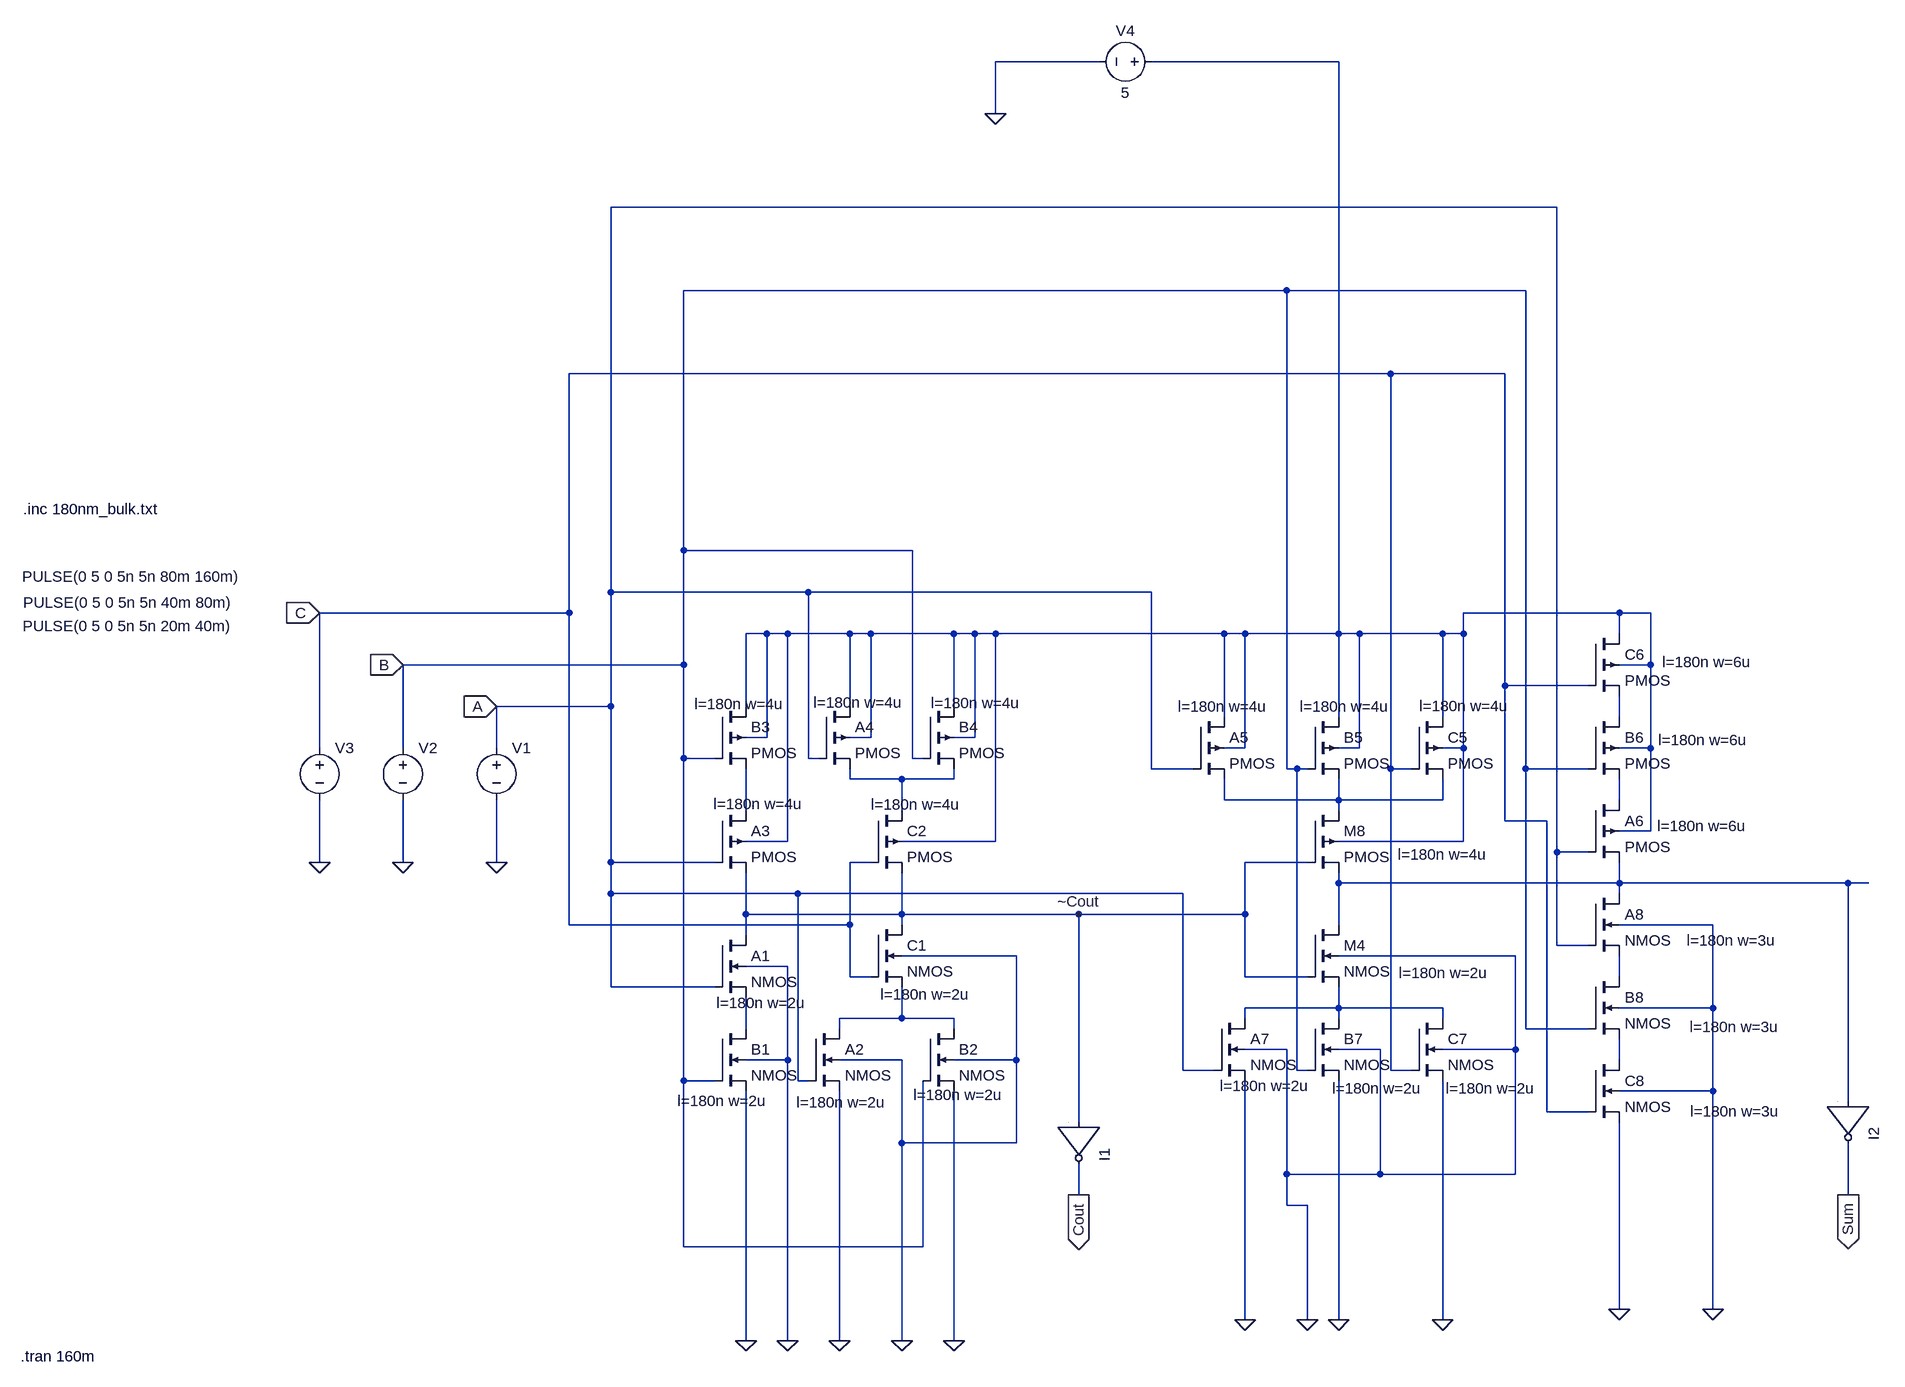
[diagram p0: schematic Full_Adder_1.asc]
Full_Adder_1.asc, the LTspice schematic file:
Version 4
SHEET 1 1716 680
WIRE 480 -1328 320 -1328
WIRE 848 -1328 560 -1328
WIRE 320 -1248 320 -1328
WIRE 1184 -1104 -272 -1104
WIRE 768 -976 -160 -976
WIRE 1136 -976 768 -976
WIRE 928 -848 -336 -848
WIRE 1104 -848 928 -848
WIRE -160 -576 -160 -976
WIRE 192 -576 -160 -576
WIRE -272 -512 -272 -1104
WIRE 32 -512 -272 -512
WIRE 560 -512 32 -512
WIRE -336 -480 -336 -848
WIRE -336 -480 -720 -480
WIRE 1280 -480 1040 -480
WIRE 1328 -480 1280 -480
WIRE -32 -448 -64 -448
WIRE 0 -448 -32 -448
WIRE 96 -448 0 -448
WIRE 128 -448 96 -448
WIRE 256 -448 128 -448
WIRE 288 -448 256 -448
WIRE 320 -448 288 -448
WIRE 672 -448 320 -448
WIRE 704 -448 672 -448
WIRE 848 -448 848 -1328
WIRE 848 -448 704 -448
WIRE 880 -448 848 -448
WIRE 1008 -448 880 -448
WIRE 1040 -448 1040 -480
WIRE 1040 -448 1008 -448
WIRE 1280 -448 1280 -480
WIRE -160 -400 -160 -576
WIRE -160 -400 -592 -400
WIRE 1328 -400 1328 -480
WIRE 1328 -400 1280 -400
WIRE 1104 -368 1104 -848
WIRE 1232 -368 1104 -368
WIRE -272 -336 -272 -512
WIRE -272 -336 -448 -336
WIRE -64 -336 -64 -448
WIRE 96 -336 96 -448
WIRE 256 -336 256 -448
WIRE 672 -320 672 -448
WIRE 848 -320 848 -448
WIRE 1008 -320 1008 -448
WIRE 1280 -320 1280 -352
WIRE -32 -288 -32 -448
WIRE -32 -288 -64 -288
WIRE 128 -288 128 -448
WIRE 128 -288 96 -288
WIRE 288 -288 288 -448
WIRE 288 -288 256 -288
WIRE -720 -272 -720 -480
WIRE -592 -272 -592 -400
WIRE -448 -272 -448 -336
WIRE 704 -272 704 -448
WIRE 704 -272 672 -272
WIRE 880 -272 880 -448
WIRE 880 -272 848 -272
WIRE 1040 -272 1040 -448
WIRE 1040 -272 1008 -272
WIRE 1328 -272 1328 -400
WIRE 1328 -272 1280 -272
WIRE -160 -256 -160 -400
WIRE -112 -256 -160 -256
WIRE 32 -256 32 -512
WIRE 48 -256 32 -256
WIRE 192 -256 192 -576
WIRE 208 -256 192 -256
WIRE 560 -240 560 -512
WIRE 624 -240 560 -240
WIRE 768 -240 768 -976
WIRE 784 -240 768 -240
WIRE 800 -240 784 -240
WIRE 928 -240 928 -848
WIRE 960 -240 928 -240
WIRE 1136 -240 1136 -976
WIRE 1232 -240 1136 -240
WIRE 96 -224 96 -240
WIRE 176 -224 96 -224
WIRE 256 -224 256 -240
WIRE 256 -224 176 -224
WIRE 672 -192 672 -224
WIRE 848 -192 848 -224
WIRE 848 -192 672 -192
WIRE 1008 -192 1008 -224
WIRE 1008 -192 848 -192
WIRE 1280 -192 1280 -224
WIRE -64 -176 -64 -240
WIRE 176 -176 176 -224
WIRE 848 -176 848 -192
WIRE 1104 -160 1104 -368
WIRE 1168 -160 1104 -160
WIRE 1328 -144 1328 -272
WIRE 1328 -144 1280 -144
WIRE 0 -128 0 -448
WIRE 0 -128 -64 -128
WIRE 320 -128 320 -448
WIRE 320 -128 176 -128
WIRE 1040 -128 1040 -272
WIRE 1040 -128 848 -128
WIRE 1184 -112 1184 -1104
WIRE 1232 -112 1184 -112
WIRE -720 -96 -720 -192
WIRE -592 -96 -592 -192
WIRE -448 -96 -448 -192
WIRE -272 -96 -272 -336
WIRE -112 -96 -272 -96
WIRE 128 -96 96 -96
WIRE 800 -96 704 -96
WIRE 848 -64 848 -80
WIRE 1280 -64 1280 -96
WIRE 1280 -64 848 -64
WIRE 1632 -64 1280 -64
WIRE 1664 -64 1632 -64
WIRE -272 -48 -272 -96
WIRE 16 -48 -272 -48
WIRE 608 -48 16 -48
WIRE 1280 -48 1280 -64
WIRE -64 -16 -64 -80
WIRE 176 -16 176 -80
WIRE 176 -16 -64 -16
WIRE 448 -16 176 -16
WIRE 704 -16 704 -96
WIRE 704 -16 448 -16
WIRE -336 0 -336 -480
WIRE 96 0 96 -96
WIRE 96 0 -336 0
WIRE 176 0 176 -16
WIRE 848 0 848 -64
WIRE 1424 0 1280 0
WIRE -64 16 -64 -16
WIRE 1184 32 1184 -112
WIRE 1232 32 1184 32
WIRE 352 48 176 48
WIRE 1120 48 848 48
WIRE 0 64 -64 64
WIRE 96 80 96 0
WIRE 128 80 96 80
WIRE 704 80 704 -16
WIRE 800 80 704 80
WIRE 1280 80 1280 48
WIRE -272 96 -272 -48
WIRE -112 96 -272 96
WIRE 848 128 848 96
WIRE 848 128 704 128
WIRE 1008 128 848 128
WIRE 1424 128 1424 0
WIRE 1424 128 1280 128
WIRE 176 144 176 96
WIRE 176 144 80 144
WIRE 256 144 176 144
WIRE 704 144 704 128
WIRE 848 144 848 128
WIRE 1008 144 1008 128
WIRE -64 160 -64 112
WIRE 80 160 80 144
WIRE 256 160 256 144
WIRE 1136 160 1136 -240
WIRE 1232 160 1136 160
WIRE 768 192 704 192
WIRE 912 192 848 192
WIRE 1120 192 1120 48
WIRE 1120 192 1008 192
WIRE 0 208 0 64
WIRE 0 208 -64 208
WIRE 176 208 80 208
WIRE 352 208 352 48
WIRE 352 208 256 208
WIRE 1280 208 1280 176
WIRE 608 224 608 -48
WIRE 656 224 608 224
WIRE 784 224 784 -240
WIRE 800 224 784 224
WIRE 928 224 928 -240
WIRE 960 224 928 224
WIRE -160 240 -160 -256
WIRE -112 240 -160 240
WIRE 16 240 16 -48
WIRE 32 240 16 240
WIRE 1424 256 1424 128
WIRE 1424 256 1280 256
WIRE 1632 272 1632 -64
WIRE 1168 288 1168 -160
WIRE 1232 288 1168 288
WIRE 448 304 448 -16
WIRE 176 336 176 208
WIRE 352 336 352 208
WIRE 352 336 176 336
WIRE 768 384 768 192
WIRE 912 384 912 192
WIRE 912 384 768 384
WIRE 1120 384 1120 192
WIRE 1120 384 912 384
WIRE 448 416 448 368
WIRE 1632 416 1632 336
WIRE 768 432 768 384
WIRE 800 432 768 432
WIRE -160 496 -160 240
WIRE 208 496 208 240
WIRE 208 496 -160 496
WIRE 1280 592 1280 304
WIRE 1424 592 1424 256
WIRE 704 608 704 240
WIRE 800 608 800 432
WIRE 848 608 848 240
WIRE 1008 608 1008 240
WIRE -64 640 -64 256
WIRE 0 640 0 208
WIRE 80 640 80 256
WIRE 176 640 176 336
WIRE 256 640 256 256
FLAG 448 -16 ~Cout
FLAG -64 640 0
FLAG 80 640 0
FLAG 256 640 0
FLAG 0 640 0
FLAG 176 640 0
FLAG 704 608 0
FLAG 848 608 0
FLAG 1008 608 0
FLAG 800 608 0
FLAG 1280 592 0
FLAG 1424 592 0
FLAG -448 -96 0
FLAG -592 -96 0
FLAG -720 -96 0
FLAG 320 -1248 0
FLAG -720 -480 C
IOPIN -720 -480 In
FLAG -448 -336 A
IOPIN -448 -336 In
FLAG -592 -400 B
IOPIN -592 -400 In
FLAG 448 416 Cout
IOPIN 448 416 Out
FLAG 1632 416 Sum
IOPIN 1632 416 Out
SYMBOL nmos4 208 160 R0
WINDOW 123 -14 102 Left 2
SYMATTR InstName B2
SYMATTR Value2 l=180n w=2u
SYMBOL nmos4 32 160 R0
WINDOW 123 -18 113 Left 2
SYMATTR InstName A2
SYMATTR Value2 l=180n w=2u
SYMBOL nmos4 128 0 R0
WINDOW 123 15 107 Left 2
SYMATTR InstName C1
SYMATTR Value2 l=180n w=2u
SYMBOL nmos4 -112 16 R0
WINDOW 123 3 104 Left 2
SYMATTR InstName A1
SYMATTR Value2 l=180n w=2u
SYMBOL nmos4 -112 160 R0
WINDOW 123 -57 111 Left 2
SYMATTR InstName B1
SYMATTR Value2 l=180n w=2u
SYMBOL pmos4 128 -176 R0
WINDOW 123 0 -9 Left 2
SYMATTR InstName C2
SYMATTR Value2 l=180n w=4u
SYMBOL pmos4 48 -336 R0
WINDOW 123 -8 -6 Left 2
SYMATTR InstName A4
SYMATTR Value2 l=180n w=4u
SYMBOL pmos4 208 -336 R0
WINDOW 123 13 -5 Left 2
SYMATTR InstName B4
SYMATTR Value2 l=180n w=4u
SYMBOL pmos4 -112 -176 R0
WINDOW 123 -2 -10 Left 2
SYMATTR InstName A3
SYMATTR Value2 l=180n w=4u
SYMBOL pmos4 -112 -336 R0
WINDOW 123 -31 -4 Left 2
SYMATTR InstName B3
SYMATTR Value2 l=180n w=4u
SYMBOL Digital\\inv 512 304 R90
SYMATTR InstName I1
SYMBOL nmos4 656 144 R0
WINDOW 123 9 104 Left 2
SYMATTR InstName A7
SYMATTR Value2 l=180n w=2u
SYMBOL nmos4 800 144 R0
WINDOW 123 38 108 Left 2
SYMATTR InstName B7
SYMATTR Value2 l=180n w=2u
SYMBOL nmos4 960 144 R0
WINDOW 123 53 108 Left 2
SYMATTR InstName C7
SYMATTR Value2 l=180n w=2u
SYMBOL nmos4 800 0 R0
WINDOW 123 141 74 Left 2
SYMATTR InstName M4
SYMATTR Value2 l=180n w=2u
SYMBOL nmos4 1232 -48 R0
WINDOW 123 152 72 Left 2
SYMATTR InstName A8
SYMATTR Value2 l=180n w=3u
SYMBOL nmos4 1232 80 R0
WINDOW 123 156 77 Left 2
SYMATTR InstName B8
SYMATTR Value2 l=180n w=3u
SYMBOL nmos4 1232 208 R0
WINDOW 123 157 79 Left 2
SYMATTR InstName C8
SYMATTR Value2 l=180n w=3u
SYMBOL pmos4 800 -176 R0
WINDOW 123 139 68 Left 2
SYMATTR InstName M8
SYMATTR Value2 l=180n w=4u
SYMBOL pmos4 624 -320 R0
WINDOW 123 -23 -16 Left 2
SYMATTR InstName A5
SYMATTR Value2 l=180n w=4u
SYMBOL pmos4 800 -320 R0
WINDOW 123 -12 -16 Left 2
SYMATTR InstName B5
SYMATTR Value2 l=180n w=4u
SYMBOL pmos4 960 -320 R0
WINDOW 123 12 -17 Left 2
SYMATTR InstName C5
SYMATTR Value2 l=180n w=4u
SYMBOL pmos4 1232 -192 R0
WINDOW 123 106 40 Left 2
SYMATTR InstName A6
SYMATTR Value2 l=180n w=6u
SYMBOL pmos4 1232 -320 R0
WINDOW 123 108 36 Left 2
SYMATTR InstName B6
SYMATTR Value2 l=180n w=6u
SYMBOL pmos4 1232 -448 R0
WINDOW 123 114 44 Left 2
SYMATTR InstName C6
SYMATTR Value2 l=180n w=6u
SYMBOL voltage -448 -288 R0
WINDOW 3 -730 -248 Left 2
WINDOW 123 0 0 Left 0
WINDOW 39 0 0 Left 0
SYMATTR InstName V1
SYMATTR Value PULSE(0 5 0 5n 5n 80m 160m)
SYMBOL voltage -592 -288 R0
WINDOW 3 -584 -208 Left 2
WINDOW 123 0 0 Left 0
WINDOW 39 0 0 Left 0
SYMATTR InstName V2
SYMATTR Value PULSE(0 5 0 5n 5n 40m 80m)
SYMBOL voltage -720 -288 R0
WINDOW 3 -457 -172 Left 2
WINDOW 123 0 0 Left 0
WINDOW 39 0 0 Left 0
SYMATTR InstName V3
SYMATTR Value PULSE(0 5 0 5n 5n 20m 40m)
SYMBOL voltage 576 -1328 R90
WINDOW 0 -32 56 VBottom 2
WINDOW 3 32 56 VTop 2
WINDOW 123 0 0 Left 0
WINDOW 39 0 0 Left 0
SYMATTR InstName V4
SYMATTR Value 5
SYMBOL Digital\\inv 1696 272 R90
SYMATTR InstName I2
TEXT -1176 -640 Left 2 !.inc 180nm_bulk.txt
TEXT -1180 664 Left 2 !.tran 160m

The netlist it stands for:
* Full_Adder_1.asc
M§B2 N010 B 0 0 NMOS l=180n w=2u
M§A2 N010 A 0 0 NMOS l=180n w=2u
M§C1 ~Cout C N010 0 NMOS l=180n w=2u
M§A1 ~Cout A N011 0 NMOS l=180n w=2u
M§B1 N011 B 0 0 NMOS l=180n w=2u
M§C2 N003 C ~Cout N001 PMOS l=180n w=4u
M§A4 N001 A N003 N001 PMOS l=180n w=4u
M§B4 N001 B N003 N001 PMOS l=180n w=4u
M§A3 N006 A ~Cout N001 PMOS l=180n w=4u
M§B3 N001 B N006 N001 PMOS l=180n w=4u
A§I1 ~Cout 0 0 0 0 Cout 0 0 BUF
M§A7 N009 A 0 0 NMOS l=180n w=2u
M§B7 N009 B 0 0 NMOS l=180n w=2u
M§C7 N009 C 0 0 NMOS l=180n w=2u
M4 N007 ~Cout N009 0 NMOS l=180n w=2u
M§A8 N007 A N008 0 NMOS l=180n w=3u
M§B8 N008 B N012 0 NMOS l=180n w=3u
M§C8 N012 C 0 0 NMOS l=180n w=3u
M8 N004 ~Cout N007 N001 PMOS l=180n w=4u
M§A5 N001 A N004 N001 PMOS l=180n w=4u
M§B5 N001 B N004 N001 PMOS l=180n w=4u
M§C5 N001 C N004 N001 PMOS l=180n w=4u
M§A6 N005 A N007 N001 PMOS l=180n w=6u
M§B6 N002 B N005 N001 PMOS l=180n w=6u
M§C6 N001 C N002 N001 PMOS l=180n w=6u
V1 A 0 PULSE(0 5 0 5n 5n 80m 160m)
V2 B 0 PULSE(0 5 0 5n 5n 40m 80m)
V3 C 0 PULSE(0 5 0 5n 5n 20m 40m)
V4 N001 0 5
A§I2 N007 0 0 0 0 Sum 0 0 BUF
.model NMOS NMOS
.model PMOS PMOS
.lib standard.mos
.inc 180nm_bulk.txt
.tran 160m
.backanno
.end

* Results of the author's LTspice run, read from the files saved beside the schematic
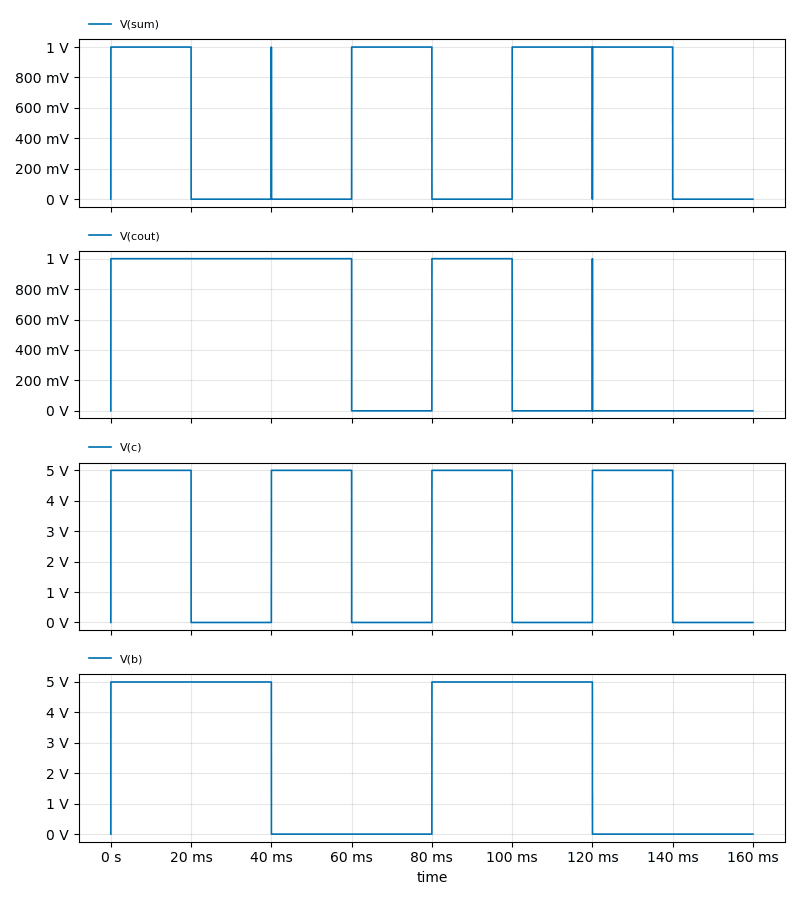
[diagram p1: Transient Analysis of Full_Adder_1.asc, plotted from the saved traces]
* Transient Analysis, 1 run:
*   V(sum): min 0 V, max 1 V, average 500 mV, rms 707.1 mV, last 0 V
*   V(cout): min 0 V, max 1 V, average 500 mV, rms 707.1 mV, last 0 V
*   V(c): min 0 V, max 5 V, average 2.5 V, rms 3.536 V, last 0 V
*   V(b): min 0 V, max 5 V, average 2.5 V, rms 3.536 V, last 0 V